# Altium schematic sheet Microcontroller.SchDoc
size A; SheetNumber: 3; SheetTotal: 5
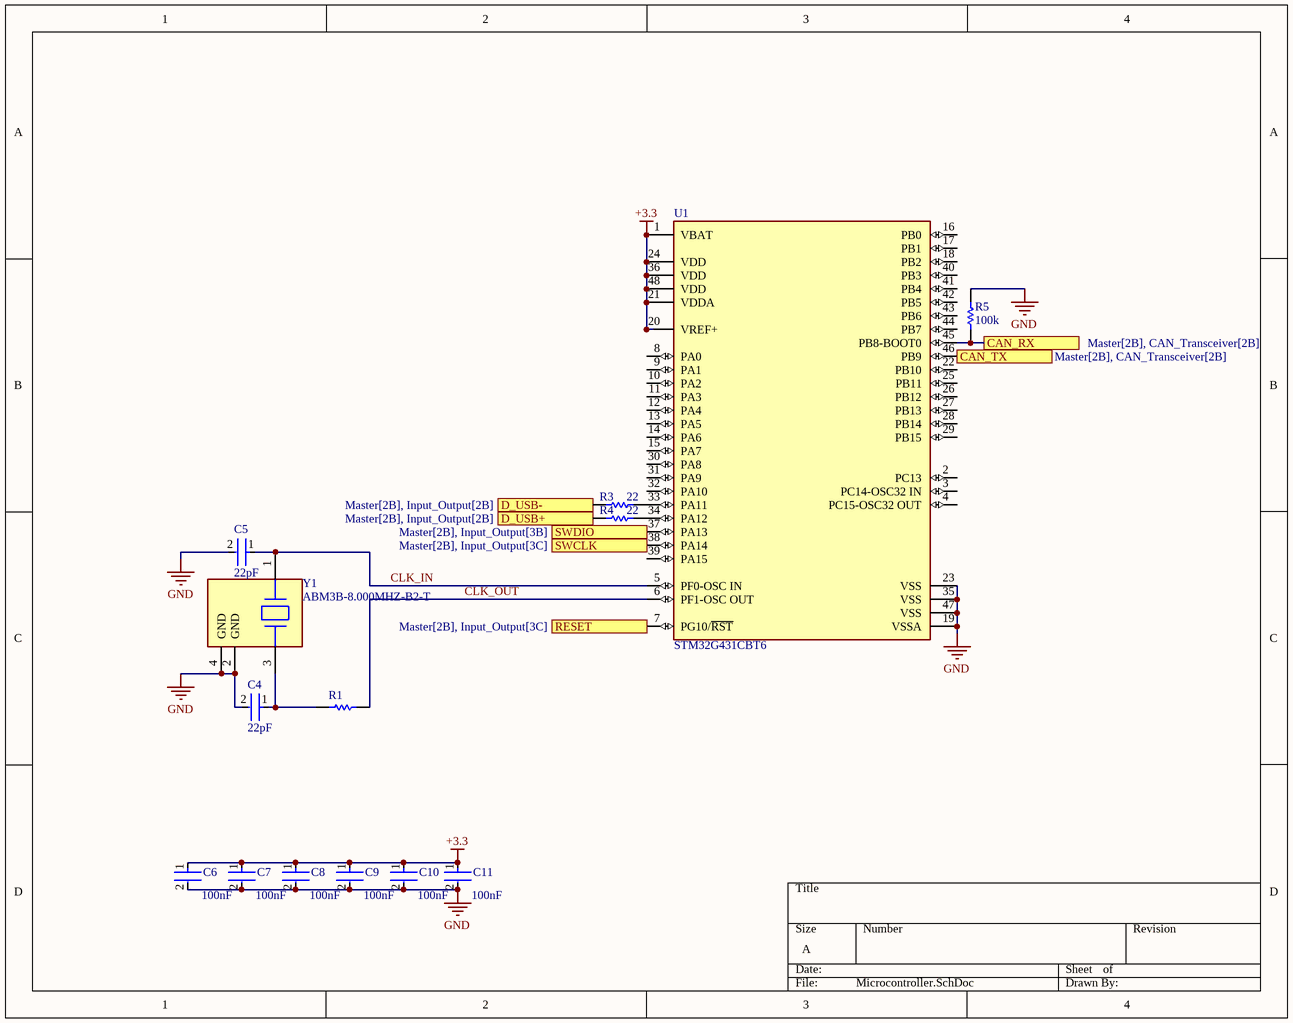
[diagram p0: Microcontroller.SchDoc]

## Parts
C4  22pF  [CAPC0603(1608)100_L]
C5  22pF  [CAPC0603(1608)100_L]
C6  100nF  [CAPC0603(1608)100_L]
C7  100nF  [CAPC0603(1608)100_L]
C8  100nF  [CAPC0603(1608)100_L]
C9  100nF  [CAPC0603(1608)100_L]
C10  100nF  [CAPC0603(1608)100_L]
C11  100nF  [CAPC0603(1608)100_L]
R1  RES 0805  [RESC2013X50X30ML20T20]  (value not drawn)
R3  22  [RESC2013X50X30ML20T20]
R4  22  [RESC2013X50X30ML20T20]
R5  100k  [RESC2013X50X30ML20T20]
U1  STM32G431CBT6  [FP-LQFP48-5B-MFG]
Y1  ABM3B-8.000MHZ-B2-T  [FP-ABM3B-MFG]

## Ports
CAN_RX (see Master[2B], CAN_Transceiver[2B]), CAN_TX (see Master[2B], CAN_Transceiver[2B]), D_USB+ (see Master[2B], Input_Output[2B]), D_USB- (see Master[2B], Input_Output[2B]), RESET (see Master[2B], Input_Output[3C]), SWCLK (see Master[2B], Input_Output[3C]), SWDIO (see Master[2B], Input_Output[3B])

## Nets
+3.3: C6.1 C7.1 C8.1 C9.1 C10.1 C11.1 U1.1(VBAT) U1.20(VREF+) U1.21(VDDA) U1.24(VDD) U1.36(VDD) U1.48(VDD)
GND: C4.2 C5.2 C6.2 C7.2 C8.2 C9.2 C10.2 C11.2 R5.2 U1.19(VSSA) U1.23(VSS) U1.35(VSS) U1.47(VSS) Y1.2(GND) Y1.4(GND)
CAN_RX: R5.1 U1.45(PB8-BOOT0) ; port CAN_RX
CAN_TX: U1.46(PB9) ; port CAN_TX
CLK_IN: C5.1 U1.5(PF0-OSC_IN) Y1.1
CLK_OUT: R1.2 U1.6(PF1-OSC_OUT)
D_USB+: R4.1 ; port D_USB+
D_USB-: R3.1 ; port D_USB-
RESET: U1.7(PG10/~{RST}) ; port RESET
SWCLK: U1.38(PA14) ; port SWCLK
SWDIO: U1.37(PA13) ; port SWDIO
NetC4_1: C4.1 R1.1 Y1.3
NetR3_2: R3.2 U1.33(PA11)
NetR4_2: R4.2 U1.34(PA12)

Not connected (* = marked no-connect by the designer): U1 2(PC13) 3(PC14-OSC32_IN) 4(PC15-OSC32_OUT) 8(PA0) 9(PA1) 10(PA2) 11(PA3) 12(PA4) 13(PA5) 14(PA6) 15(PA7) 16(PB0) 17(PB1) 18(PB2) 22(PB10) 25(PB11) 26(PB12) 27(PB13) 28(PB14) 29(PB15) 30(PA8) 31(PA9) 32(PA10) 39(PA15) 40(PB3) 41(PB4) 42(PB5) 43(PB6) 44(PB7)

## Library data of the parts
C4-C11 = CMP-001-00083-4: GENERIC CAPACITOR 0805 or 0603(1608)
R1 R3-R5 = CMP-009-00177-4: Surface Mount 0805 Resistor
U1 = CMP-12105-000030-1: MAINSTREAM ARM CORTEX-M4+ MCU 17; Manufacturer: STMicroelectronics; Number Of Adc Channels: 17; Number Of I/Os: 38; Standoff Height: 0.05mm; Number Of Usb Channels: 1; Data Bus Width: 32bits; Number Of I2C Channels: 3; Number Of Pwm Channels: 31; Frequency: 170MHz; Memory Type: FLASH; Number Of Timers/Counters: 14; Ram Size: 32KBytes; Max Junction Temp: +105°C; Memory Size: 128KBytes; Min Supply Voltage: 1.62V; Max Supply Voltage: 3.6V; Number Of Uart Channels: 4; Interface: I2C,SPI,UART,USART,CAN,USB,LIN,IrDA,I2S; Temperature Range Low: -40°C; Lead Free: Yes; Device Class L3: Microcontrollers; Number Of Cores: 1; Temperature Range High: +85°C; Height: 1.6mm; Digikey Description: MAINSTREAM ARM CORTEX-M4+ MCU 17; Device Class L1: Integrated Circuits (ICs); Package: LQFP48-5B; RoHS: TRUE; Number Of A/D Converters: 1; Core Architecture: Arm Cortex-M4; Device Class L2: Embedded Processors and Controllers; ComponentLink2Description: Datasheet; Temperature: -40°C to +85°C; Ambient Temperature Range High: +85°C; Ambient Temperature Range Low: -40°C; Octopart: https://octopart.com/stm32g431cbt6-stmicroelectronics-98835224; ComponentLink2URL: https://www.st.com/resource/en/datasheet/stm32g431cb.pdf; Automotive: No; Number Of Spi Channels: 3; Manufacturer Part Number: STM32G431CBT6; Category: IC
Y1 = CMP-1688-00002-2: Crystal 8MHz ±20ppm 18pF SMD-4 5mm x 3.2mm; ESR (Equivalent Series Resistance): 200R; Frequency Stability: 50ppm; Operating Frequency: 8 MHz; Mount: Surface Mount; Number of Pins: 4; Packaging: Tape and Reel; Width: 0.126inch; Case/Package: CSMD; Lead Free: Lead Free; Depth: 3.2mm; Load Capacitance: 18pF; Min Operating Temperature: -20°C; Series: ABM3B; Package Quantity: 1000; Resistor Type: Ceramic; Height: 0.043inch; Max Operating Temperature: 70°C; Frequency Tolerance: 20ppm; Series Resistance: 200R; Tolerance: 20ppm; Termination: SMD/SMT; Length: 5mm; Frequency: 8MHz